# Altium project DSO_Template.PrjPCB
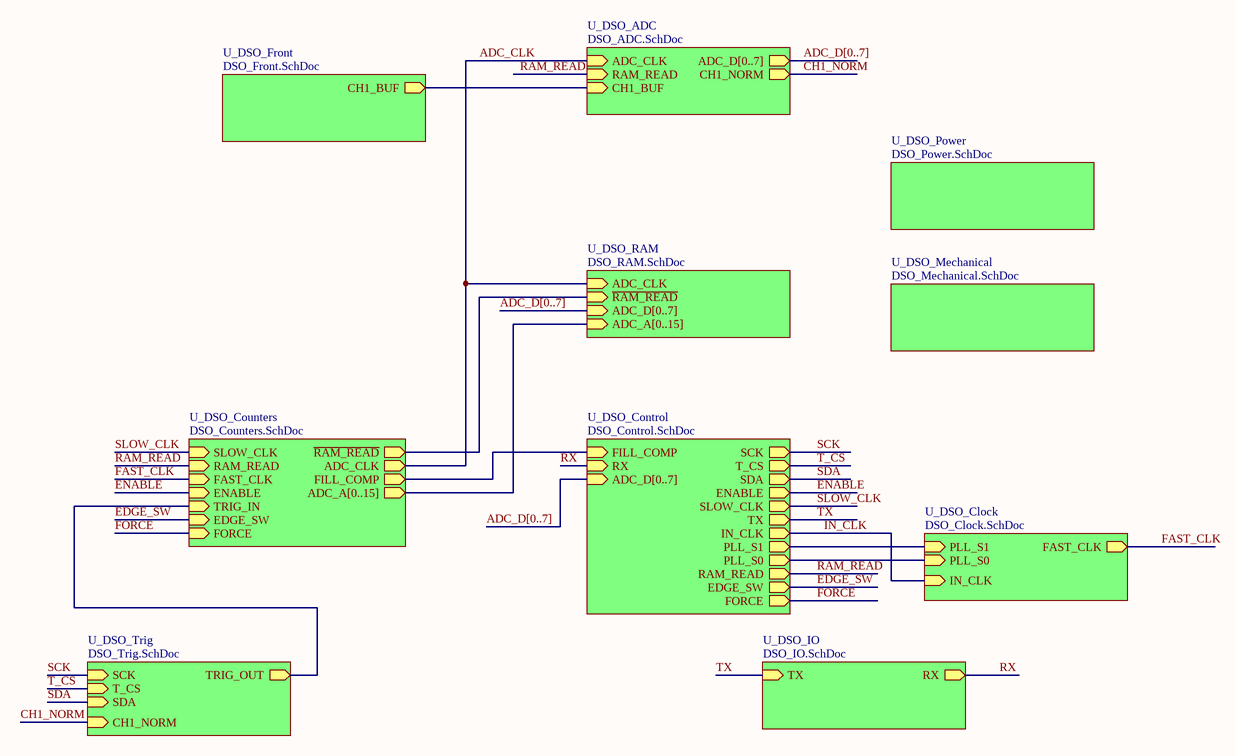
[diagram p0: DSO_Top.SchDoc]
12 sheets, 123 parts. Net scope: hierarchical (ports join the sheet entries above them; power ports are global).
Board file: DSO.PcbDoc
Sheets:
  DSO_Top.SchDoc
    U_DSO_Front = DSO_Front.SchDoc
    U_DSO_ADC = DSO_ADC.SchDoc
    U_DSO_RAM = DSO_RAM.SchDoc
    U_DSO_Counters = DSO_Counters.SchDoc
      U_DSO_CPLD = DSO_CPLD.SchDoc
    U_DSO_Control = DSO_Control.SchDoc
    U_DSO_Trig = DSO_Trig.SchDoc
    U_DSO_Clock = DSO_Clock.SchDoc
    U_DSO_IO = DSO_IO.SchDoc
    U_DSO_Power = DSO_Power.SchDoc
    U_DSO_Mechanical = DSO_Mechanical.SchDoc

## Sheet DSO_Top.SchDoc: DSO_Top
size A4; CompanyName: University of Melbourne; DrawnBy: Yijie Tao; Engineer: Yijie Tao; DocumentNumber: 1; Revision: 0.1; SheetNumber: 1; SheetTotal: 1; Title_Project: DSO; StudentNo: Student No. 755391

### Sub-sheets
U_DSO_ADC = DSO_ADC.SchDoc: ADC_CLK (in), ADC_D[0..7] (out), RAM_READ (in), CH1_BUF (in), CH1_NORM (out)
U_DSO_Clock = DSO_Clock.SchDoc: FAST_CLK (out), PLL_S0 (in), PLL_S1 (in), IN_CLK (in)
U_DSO_Control = DSO_Control.SchDoc: SCK (out), T_CS (out), SDA (out), ENABLE (out), FILL_COMP (in), SLOW_CLK (out), TX (out), RX (in), IN_CLK (out), PLL_S1 (out), PLL_S0 (out), RAM_READ (out), ADC_D[0..7] (in), EDGE_SW (out), FORCE (out)
U_DSO_Counters = DSO_Counters.SchDoc: SLOW_CLK (in), ~{RAM_READ} (out), ADC_CLK (out), RAM_READ (in), FAST_CLK (in), FILL_COMP (out), ENABLE (in), TRIG_IN (in), EDGE_SW (in), FORCE (in), ADC_A[0..15] (out)
U_DSO_Front = DSO_Front.SchDoc: CH1_BUF (out)
U_DSO_IO = DSO_IO.SchDoc: TX (in), RX (out)
U_DSO_Mechanical = DSO_Mechanical.SchDoc: no entries
U_DSO_Power = DSO_Power.SchDoc: no entries
U_DSO_RAM = DSO_RAM.SchDoc: ADC_CLK (in), ~{RAM_READ} (in), ADC_D[0..7] (in), ADC_A[0..15] (in)
U_DSO_Trig = DSO_Trig.SchDoc: TRIG_OUT (out), SCK (in), T_CS (in), SDA (in), CH1_NORM (in)

### Nets
ADC_CLK: sheet U_DSO_ADC/ADC_CLK, sheet U_DSO_RAM/ADC_CLK, sheet U_DSO_Counters/ADC_CLK
CH1_NORM: sheet U_DSO_ADC/CH1_NORM, sheet U_DSO_Trig/CH1_NORM
EDGE_SW: sheet U_DSO_Counters/EDGE_SW, sheet U_DSO_Control/EDGE_SW
ENABLE: sheet U_DSO_Counters/ENABLE, sheet U_DSO_Control/ENABLE
FAST_CLK: sheet U_DSO_Counters/FAST_CLK, sheet U_DSO_Clock/FAST_CLK
FILL_COMP: sheet U_DSO_Counters/FILL_COMP, sheet U_DSO_Control/FILL_COMP
FORCE: sheet U_DSO_Counters/FORCE, sheet U_DSO_Control/FORCE
IN_CLK: sheet U_DSO_Control/IN_CLK, sheet U_DSO_Clock/IN_CLK
~{RAM_READ}: sheet U_DSO_RAM/~{RAM_READ}, sheet U_DSO_Counters/~{RAM_READ}
RAM_READ: sheet U_DSO_ADC/RAM_READ, sheet U_DSO_Counters/RAM_READ, sheet U_DSO_Control/RAM_READ
RX: sheet U_DSO_Control/RX, sheet U_DSO_IO/RX
SCK: sheet U_DSO_Control/SCK, sheet U_DSO_Trig/SCK
SDA: sheet U_DSO_Control/SDA, sheet U_DSO_Trig/SDA
SLOW_CLK: sheet U_DSO_Counters/SLOW_CLK, sheet U_DSO_Control/SLOW_CLK
T_CS: sheet U_DSO_Control/T_CS, sheet U_DSO_Trig/T_CS
TX: sheet U_DSO_Control/TX, sheet U_DSO_IO/TX
NetR6_2: sheet U_DSO_Front/CH1_BUF, sheet U_DSO_ADC/CH1_BUF
NetU7_4: sheet U_DSO_Control/PLL_S1, sheet U_DSO_Clock/PLL_S1
NetU7_6: sheet U_DSO_Control/PLL_S0, sheet U_DSO_Clock/PLL_S0
NetU13_12: sheet U_DSO_Counters/TRIG_IN, sheet U_DSO_Trig/TRIG_OUT

### Buses and harness runs
bus ADC_D[0..7] = sheet U_DSO_ADC/ADC_D[0..7]
bus ADC_D[0..7] = sheet U_DSO_Control/ADC_D[0..7]
bus ADC_D[0..7] = sheet U_DSO_RAM/ADC_D[0..7]
bus sheet U_DSO_Counters/ADC_A[0..15] = sheet U_DSO_RAM/ADC_A[0..15]

## Sheet DSO_Front.SchDoc: Schematic_Name
size A4; CompanyName: University of Melbourne; Engineer: Your Name Here; DocumentNumber: 1; Revision: 0.1; SheetNumber: 1; SheetTotal: 1; Title_Project: Project_Title; StudentNo: Student No.
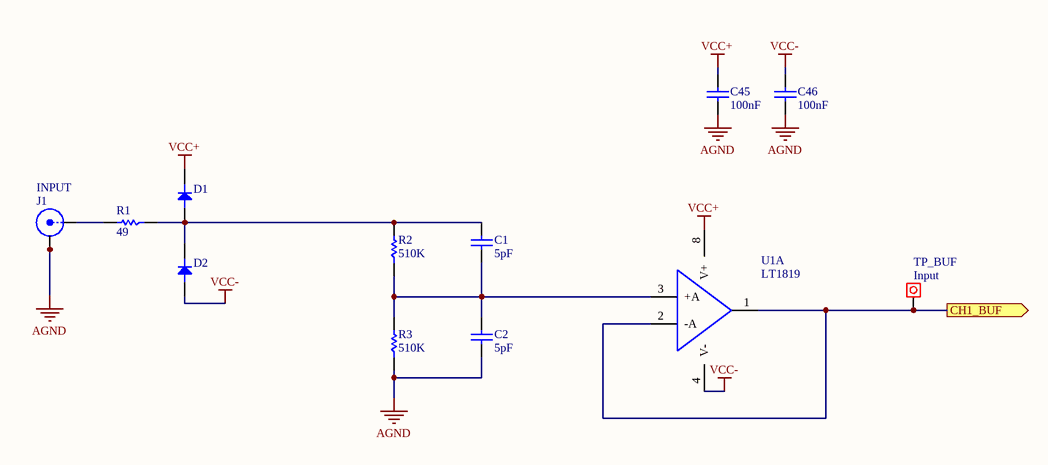
[diagram p1: DSO_Front.SchDoc]

### Parts
C1  5pF  [0805C]
C2  5pF  [0805C]
C45  100nF  [0805C]
C46  100nF  [0805C]
D1  Diode  [SOD-123]  (value not drawn)
D2  Diode  [SOD-123]  (value not drawn)
J1  INPUT  [BNC_VERT]
R1  49  [0805]
R2  510K  [0805]
R3  510K  [0805]
TP_BUF  INPUT  [Testpoin]
U1  LT1819  [SOIC-8]  (part A of 2)

### Ports
CH1_BUF (out)

### Nets
AGND: C2.2 C45.2 C46.2 J1.2(Y) J1.3(Y) J1.4(Y) J1.5(Y) R3.1
VCC+: C45.1 D1.K U1.8(V+)
VCC-: C46.1 D2.A U1.4(V-)
NetC1_1: C1.1 D1.A D2.K R1.1 R2.2
NetC1_2: C1.2 C2.1 R2.1 R3.2 U1.3(+A)
NetJ1_1: J1.1(X) R1.2
NetR6_2: TP_BUF.1 U1.1(OUTA) U1.2(-A) ; port CH1_BUF

### Library data of the parts
C1 C2 C45 C46 = C: Capacitor; Reviewed by: RM - 2018/08/05; Revision: July-2002: Re-released for DXP Platform.; Supplier 1: *; Supplier Part Number 1: *
  C1 C2: Value: 5pF
  C45 C46: Value: 100nF
D1 D2 = D: Reviewed by: RM - 2018/08/05; Revision: July-2002: Re-released for DXP Platform.; Supplier 1: *; Supplier Part Number 1: *
J1 = BNC: BNC Straight; Reviewed by: RM - 2018/08/05; Supplier Part Number 1: A97581-ND; Supplier 1: Digi-Key
R1-R3 = R: Resistor; Reviewed by: RM - 2018/08/05; Supplier 1: *; Suppler Part Number 1: *
  R1: Value: 49
  R2 R3: Value: 510K
TP_BUF = Test Point: Pad; Value: Input
U1 = LT1819: OpAmp High Frequency Dual; Reviewed by: RM - 2018/08/05; Supplier 1: Digi-Key; Supplier Part Number 1: LT1819CMS8#PBF-ND

## Sheet DSO_ADC.SchDoc: Schematic_Name
size A4; CompanyName: University of Melbourne; Engineer: Yijie Tao; DocumentNumber: 1; Revision: 0.1; SheetNumber: 1; SheetTotal: 1; Title_Project: DSO; StudentNo: Student No. 755391
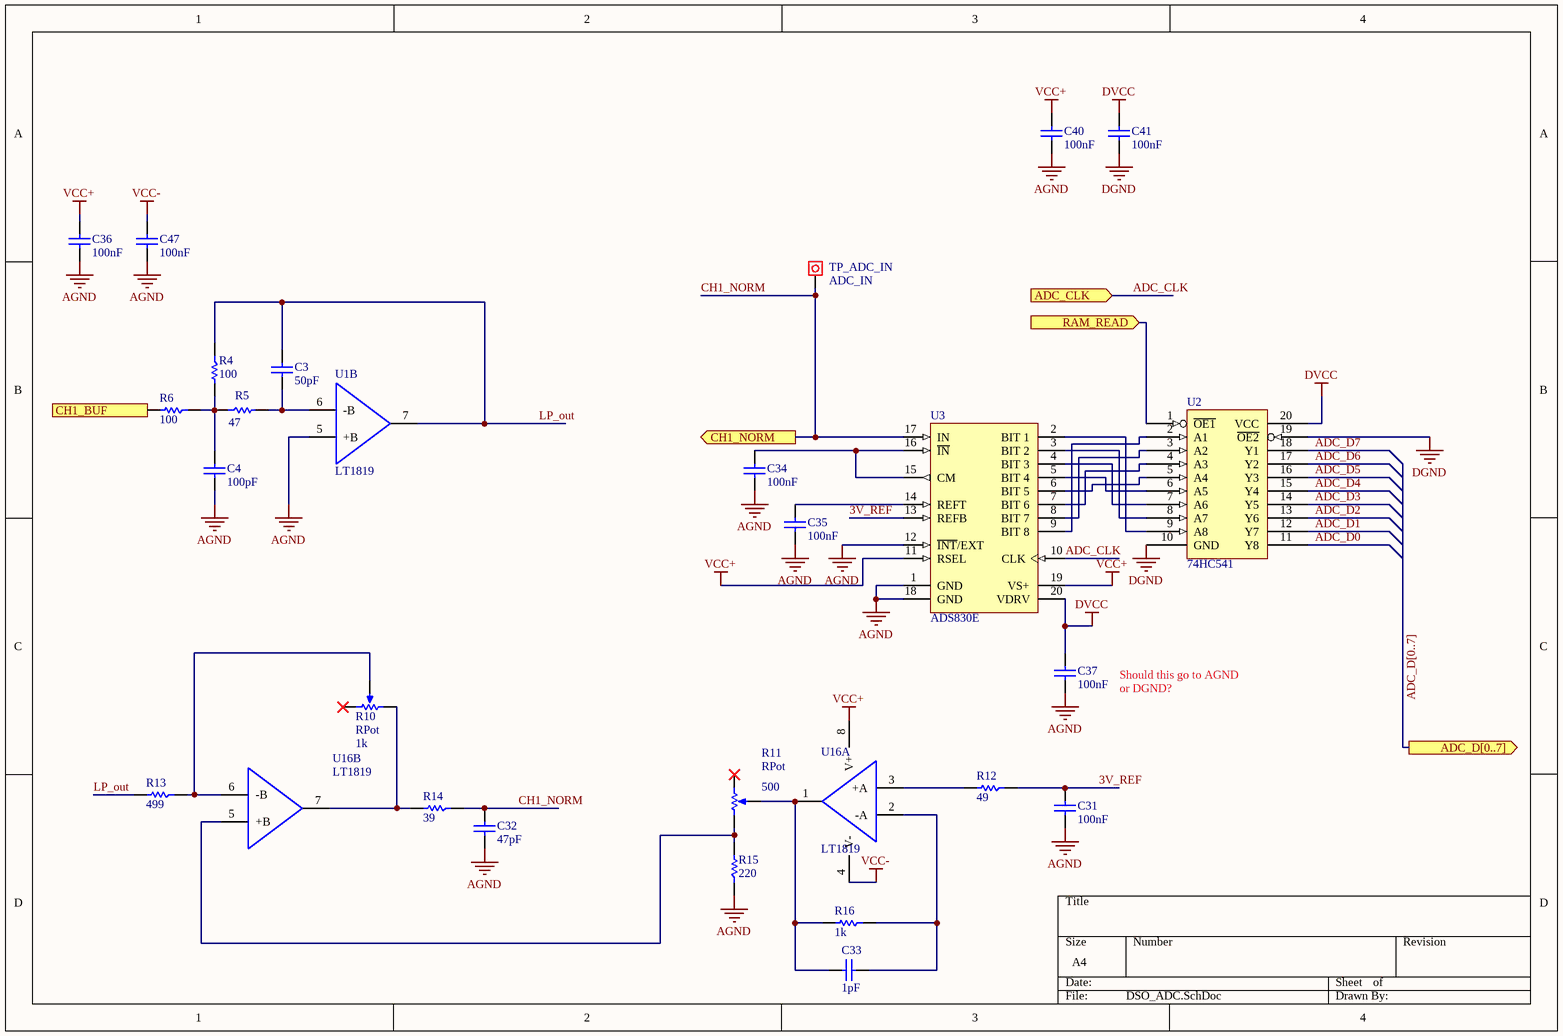
[diagram p2: DSO_ADC.SchDoc]

### Parts
C3  50pF  [0805C]
C4  100pF  [0805C]
C31  100nF  [0805C]
C32  47pF  [0805C]
C33  1pF  [0805C]
C34  100nF  [0805C]
C35  100nF  [0805C]
C36  100nF  [0805C]
C37  100nF  [0805C]
C40  100nF  [0805C]
C41  100nF  [0805C]
C47  100nF  [0805C]
R4  100  [0805]
R5  47  [0805]
R6  100  [0805]
R10  RPot  value 1k  [VR5]
R11  RPot  value 500  [VR5]
R12  49  [0805]
R13  499  [0805]
R14  39  [0805]
R15  220  [0805]
R16  1k  [0805]
TP_ADC_IN  value ADC_IN  [Testpoin]  (hidden comment: INPUT)
U1  LT1819  [SOIC-8]  (part B of 2)
U2  74HC541  [SOT163-1_N]
U3  ADS830E  [TI-DBQ20_L]
U16  LT1819  [SOIC-8]  (parts A,B of 2)

### Ports
ADC_CLK (in), ADC_D[0..7] (out), CH1_BUF (in), CH1_NORM (out), RAM_READ (in)

### Nets
AGND: C4.2 C31.2 C32.2 C34.2 C35.2 C36.2 C37.1 C40.2 C47.2 R15.1 U1.5(+B) U3.1(GND) U3.12(~{INT}/EXT) U3.18(GND)
DGND: C41.2 U2.10(GND) U2.19(~{OE2})
DVCC: C37.2 C41.1 U2.20(VCC) U3.20(VDRV)
VCC+: C36.1 C40.1 U3.11(RSEL) U3.19(VS+) U16.8(V+)
VCC-: C47.1 U16.4(V-)
3V_REF: C31.1 R12.1 U3.13(REFB)
ADC_CLK: U3.10(CLK) ; port ADC_CLK
ADC_D0: U2.11(Y8)
ADC_D1: U2.12(Y7)
ADC_D2: U2.13(Y6)
ADC_D3: U2.14(Y5)
ADC_D4: U2.15(Y4)
ADC_D5: U2.16(Y3)
ADC_D6: U2.17(Y2)
ADC_D7: U2.18(Y1)
CH1_NORM: C32.1 R14.1 TP_ADC_IN.1 U3.17(IN) ; port CH1_NORM
LP_out: C3.1 R4.1 R13.2 U1.7(OUTB)
RAM_READ: U2.1(~{OE1}) ; port RAM_READ
NetC3_2: C3.2 R5.2 U1.6(-B)
NetC4_1: C4.1 R4.2 R5.1 R6.1
NetC33_1: C33.1 R16.1 U16.2(-A)
NetC33_2: C33.2 R11.2(TAP) R16.2 U16.1(OUTA)
NetC34_1: C34.1 U3.15(CM) U3.16(~{IN})
NetC35_1: C35.1 U3.14(REFT)
NetR6_2: R6.2 ; port CH1_BUF
NetR10_1: R10.1(TOP) R14.2 U16.7(OUTB)
NetR10_2: R10.2(TAP) R13.1 U16.6(-B)
NetR11_1: R11.1(TOP) R15.2 U16.5(+B)
NetR12_2: R12.2 U16.3(+A)
NetU2_2: U2.2(A1) U3.9(BIT_8)
NetU2_3: U2.3(A2) U3.8(BIT_7)
NetU2_4: U2.4(A3) U3.7(BIT_6)
NetU2_5: U2.5(A4) U3.6(BIT_5)
NetU2_6: U2.6(A5) U3.5(BIT_4)
NetU2_7: U2.7(A6) U3.4(BIT_3)
NetU2_8: U2.8(A7) U3.3(BIT_2)
NetU2_9: U2.9(A8) U3.2(BIT_1)

Not connected (* = marked no-connect by the designer): R10 3(BOT)*; R11 3(BOT)*

### Buses and harness runs
bus ADC_D[0..7] = port ADC_D[0..7]

### Notes on the sheet
- Should this go to AGND or DGND?

### Library data of the parts
C3 C4 C31-C37 C40 C41 C47 = C: Capacitor; Reviewed by: RM - 2018/08/05; Revision: July-2002: Re-released for DXP Platform.; Supplier 1: *; Supplier Part Number 1: *
  C3: Value: 50pF
  C4: Value: 100pF
  C31 C34-C37 C40 C41 C47: Value: 100nF
  C32: Value: 47pF
  C33: Value: 1pF
R4-R6 R12-R16 = R: Resistor; Reviewed by: RM - 2018/08/05; Supplier 1: *; Suppler Part Number 1: *
  R4 R6: Value: 100
  R5: Value: 47
  R12: Value: 49
  R13: Value: 499
  R14: Value: 39
  R15: Value: 220
  R16: Value: 1k
R10 R11 = RPot: Potentiometer; Sim Note: Enter the Resistance value and the set point into parameter fields.; Set Position: 0.5; Published: 8-Jun-2000; LatestRevisionDate: 17-Jul-2002; LatestRevisionNote: Re-released for DXP Platform.; PackageReference: VR5; Publisher: Altium Limited; PackageDescription: Variable Resistor, Thru-Hole; 3 Leads
TP_ADC_IN = Test Point: Pad
U1 U16 = LT1819: as U1 on sheet DSO_Front; Supplier 1: Digi-Key; Supplier Part Number 1: LT1819CMS8#PBF-ND
U2 = 74HC541: (ADV) Octal Buffer, Line Driver; Reviewed by: RM - 2018/08/05; Supplier 1: Digi-Key; Supplier Part Number 1: 296-1202-1-ND
U3 = ADS830E: 8-Bit, 60 MSPS ADC Single-Ended / Differential Input, Internal / External Reference and Programmble Input Range, -40 to 85 degC, 20-pin SOP (DBQ20), Green (RoHS & no Sb/Br); Reviewed by: RM - 2018/08/05; ComponentLink2URL: http://www.ti.com/general/docs/lit/getliterature.tsp?genericPartNumber=ADS830&fileType=pdf; ComponentLink2Description: Datasheet; ComponentLink1URL: http://www.ti.com/; ComponentLink3URL: http://www.ti.com/litv/pdf/mpds210a; ComponentLink3Description: Package Specification; ComponentLink1Description: Manufacturer URL; Supplier 1: Digi-Key; Supplier Part Number 1: ADS830E-ND

## Sheet DSO_RAM.SchDoc: Schematic_Name
size A4; CompanyName: University of Melbourne; Engineer: Your Name Here; DocumentNumber: 1; Revision: 0.1; SheetNumber: 1; SheetTotal: 1; Title_Project: Project_Title; StudentNo: Student No.
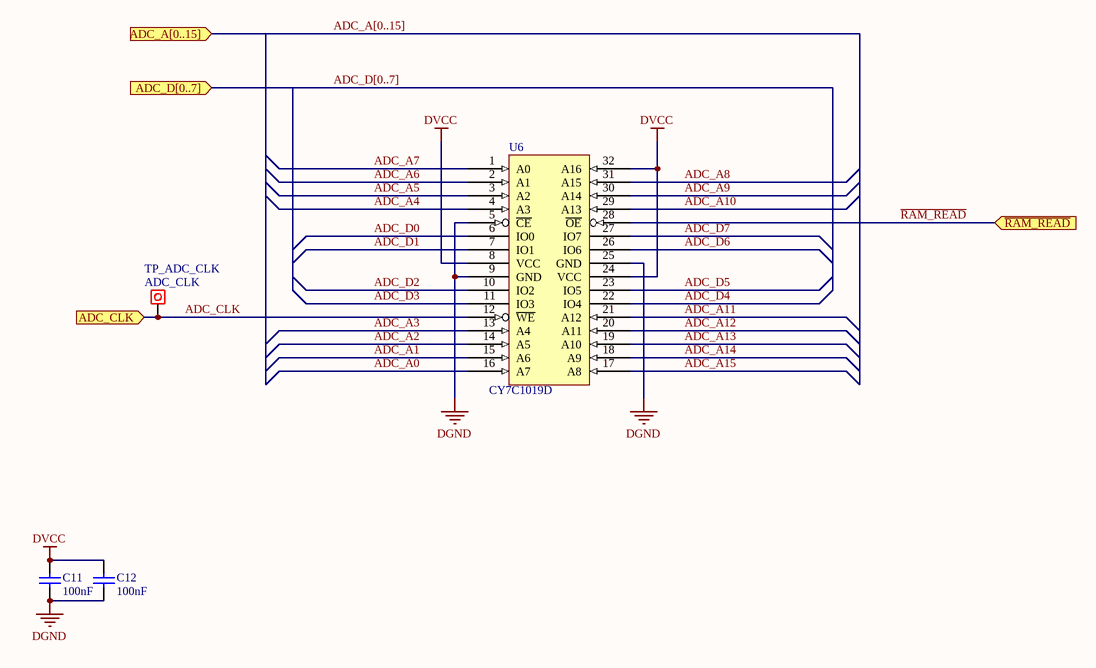
[diagram p3: DSO_RAM.SchDoc]

### Parts
C11  100nF  [0805C]
C12  100nF  [0805C]
TP_ADC_CLK  value ADC_CLK  [Testpoin]  (hidden comment: INPUT)
U6  CY7C1019D  [TSOP-32]

### Ports
ADC_A[0..15] (in), ADC_CLK (in), ADC_D[0..7] (in), ~{RAM_READ} (in)

### Nets
DGND: C11.2 C12.2 U6.5(~{CE}) U6.9(GND) U6.25(GND)
DVCC: C11.1 C12.1 U6.8(VCC) U6.24(VCC) U6.32(A16)
ADC_A0: U6.16(A7)
ADC_A1: U6.15(A6)
ADC_A2: U6.14(A5)
ADC_A3: U6.13(A4)
ADC_A4: U6.4(A3)
ADC_A5: U6.3(A2)
ADC_A6: U6.2(A1)
ADC_A7: U6.1(A0)
ADC_A8: U6.31(A15)
ADC_A9: U6.30(A14)
ADC_A10: U6.29(A13)
ADC_A11: U6.21(A12)
ADC_A12: U6.20(A11)
ADC_A13: U6.19(A10)
ADC_A14: U6.18(A9)
ADC_A15: U6.17(A8)
ADC_CLK: TP_ADC_CLK.1 U6.12(~{WE}) ; port ADC_CLK
ADC_D0: U6.6(IO0)
ADC_D1: U6.7(IO1)
ADC_D2: U6.10(IO2)
ADC_D3: U6.11(IO3)
ADC_D4: U6.22(IO4)
ADC_D5: U6.23(IO5)
ADC_D6: U6.26(IO6)
ADC_D7: U6.27(IO7)
~{RAM_READ}: U6.28(~{OE}) ; port ~{RAM_READ}

### Buses and harness runs
bus ADC_A[0..15] = port ADC_A[0..15]
bus ADC_D[0..7] = port ADC_D[0..7]

### Library data of the parts
C11 C12 = C: Capacitor; Reviewed by: RM - 2018/08/05; Revision: July-2002: Re-released for DXP Platform.; Value: 100nF; Supplier 1: *; Supplier Part Number 1: *
TP_ADC_CLK = Test Point: Pad
U6 = CY7C1019D: SRAM 128k x 8; Reviewed by: RM - 2018/08/05; Supplier 1: Digi-Key; Supplier Part Number 1: 428-1967-ND

## Sheet DSO_Counters.SchDoc: Schematic_Name
size A4; CompanyName: University of Melbourne; DrawnBy: Student_#; Engineer: Your Name Here; Organization: University of Melbourne; DocumentNumber: 5; Revision: 0.1; SheetNumber: 5; SheetTotal: 10; Title_Project: Project_Title
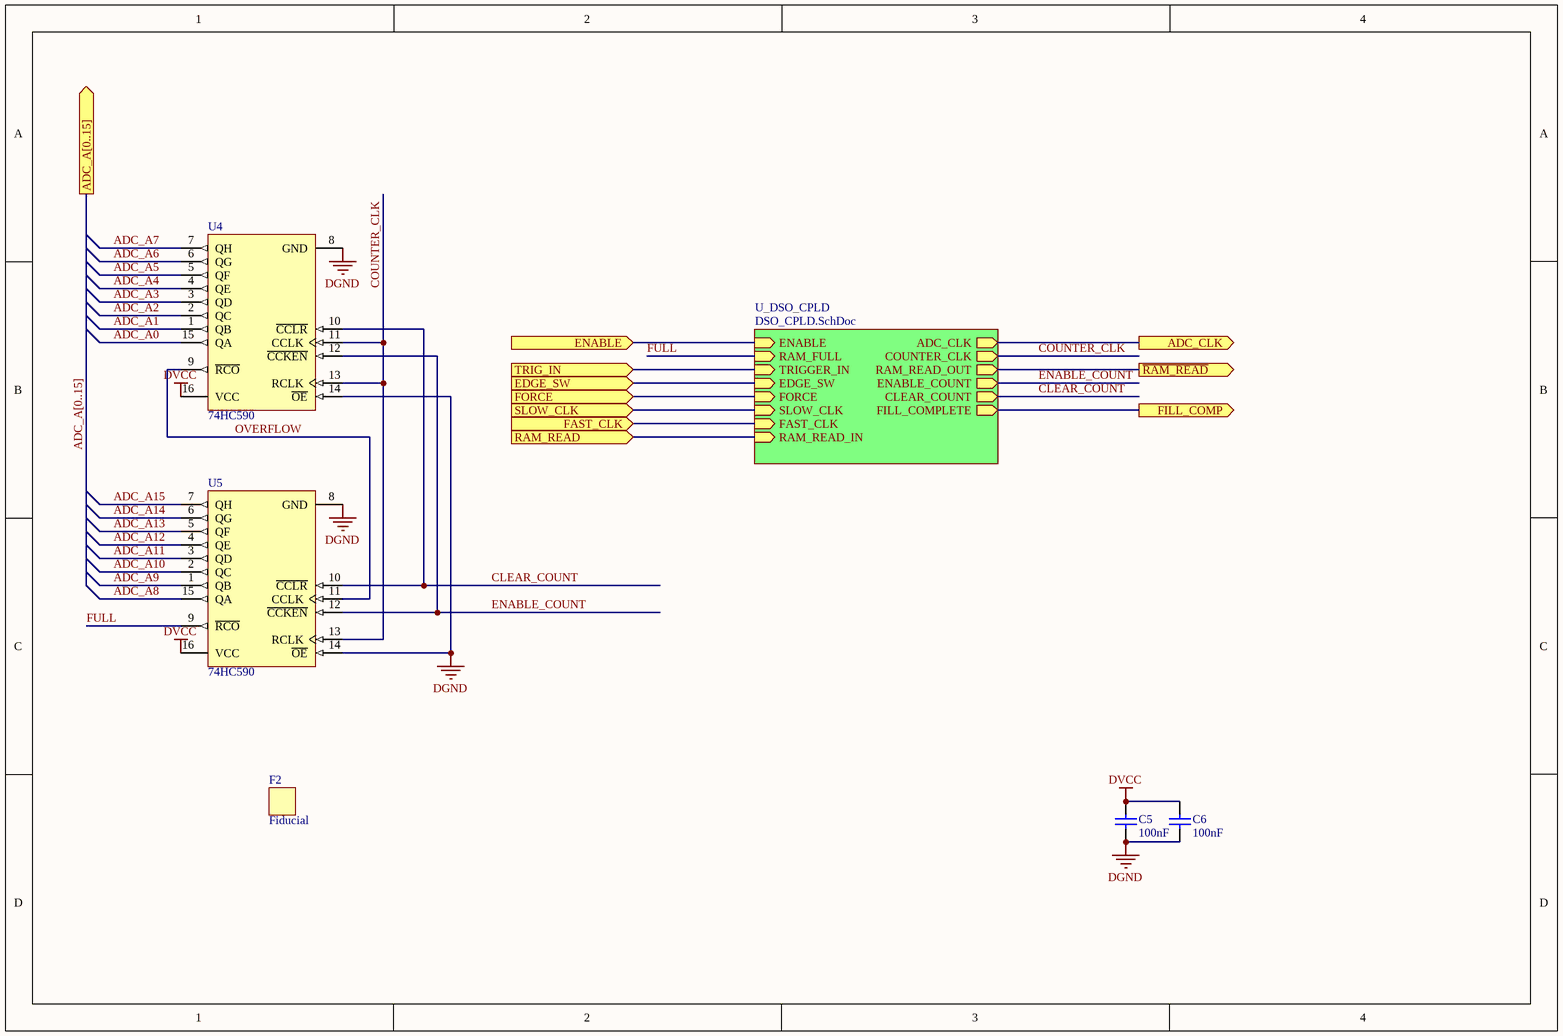
[diagram p4: DSO_Counters.SchDoc]

### Parts
C5  100nF  [0805C]
C6  100nF  [0805C]
F2  Fiducial  [Fiducial]  (no BOM)
U4  74HC590  [SOIC-16]
U5  74HC590  [SOIC-16]

### Sub-sheets
U_DSO_CPLD = DSO_CPLD.SchDoc: ENABLE (in), RAM_FULL (in), TRIGGER_IN (in), EDGE_SW (in), FORCE (in), SLOW_CLK (in), FAST_CLK (in), RAM_READ_IN (in), ADC_CLK (out), COUNTER_CLK (out), RAM_READ_OUT (out), ENABLE_COUNT (out), CLEAR_COUNT (out), FILL_COMPLETE (out)

### Ports
ADC_A[0..15] (out), ADC_CLK (out), EDGE_SW (in), ENABLE (in), FAST_CLK (in), FILL_COMP (out), FORCE (in), RAM_READ (in), SLOW_CLK (in), TRIG_IN (in), ~{RAM_READ} (out)

### Nets
DGND: C5.2 C6.2 U4.8(GND) U4.14(~{OE}) U5.8(GND) U5.14(~{OE})
DVCC: C5.1 C6.1 U4.16(VCC) U5.16(VCC)
ADC_A0: U4.15(QA)
ADC_A1: U4.1(QB)
ADC_A2: U4.2(QC)
ADC_A3: U4.3(QD)
ADC_A4: U4.4(QE)
ADC_A5: U4.5(QF)
ADC_A6: U4.6(QG)
ADC_A7: U4.7(QH)
ADC_A8: U5.15(QA)
ADC_A9: U5.1(QB)
ADC_A10: U5.2(QC)
ADC_A11: U5.3(QD)
ADC_A12: U5.4(QE)
ADC_A13: U5.5(QF)
ADC_A14: U5.6(QG)
ADC_A15: U5.7(QH)
ADC_CLK: port ADC_CLK, sheet U_DSO_CPLD/ADC_CLK
CLEAR_COUNT: U4.10(~{CCLR}) U5.10(~{CCLR}) ; sheet U_DSO_CPLD/CLEAR_COUNT
COUNTER_CLK: U4.11(CCLK) U4.13(RCLK) U5.13(RCLK) ; sheet U_DSO_CPLD/COUNTER_CLK
EDGE_SW: port EDGE_SW, sheet U_DSO_CPLD/EDGE_SW
ENABLE: port ENABLE, sheet U_DSO_CPLD/ENABLE
ENABLE_COUNT: U4.12(~{CCKEN}) U5.12(~{CCKEN}) ; sheet U_DSO_CPLD/ENABLE_COUNT
FAST_CLK: port FAST_CLK, sheet U_DSO_CPLD/FAST_CLK
FILL_COMP: port FILL_COMP, sheet U_DSO_CPLD/FILL_COMPLETE
FORCE: port FORCE, sheet U_DSO_CPLD/FORCE
FULL: U5.9(~{RCO}) ; sheet U_DSO_CPLD/RAM_FULL
OVERFLOW: U4.9(~{RCO}) U5.11(CCLK)
~{RAM_READ}: port ~{RAM_READ}, sheet U_DSO_CPLD/RAM_READ_OUT
RAM_READ: port RAM_READ, sheet U_DSO_CPLD/RAM_READ_IN
SLOW_CLK: port SLOW_CLK, sheet U_DSO_CPLD/SLOW_CLK
NetU13_12: port TRIG_IN, sheet U_DSO_CPLD/TRIGGER_IN

### Buses and harness runs
bus ADC_A[0..15] = port ADC_A[0..15]

### Library data of the parts
C5 C6 = C: Capacitor; Reviewed by: RM - 2018/08/05; Revision: July-2002: Re-released for DXP Platform.; Value: 100nF; Supplier 1: *; Supplier Part Number 1: *
U4 U5 = 74HC590: 8-Bit Binary Counter Register; Reviewed by: RM - 2018/08/05; ComponentLink1Description: Manufacturer Link; ComponentLink1URL: http://www.st.com/; ComponentLink2Description: Datasheet; ComponentLink2URL: http://www.st.com/stonline/products/literature/ds/1986/m74hc590.pdf; Supplier 1: Digi-Key; Supplier Part Number 1: 296-17132-1-ND

## Sheet DSO_CPLD.SchDoc
size A4
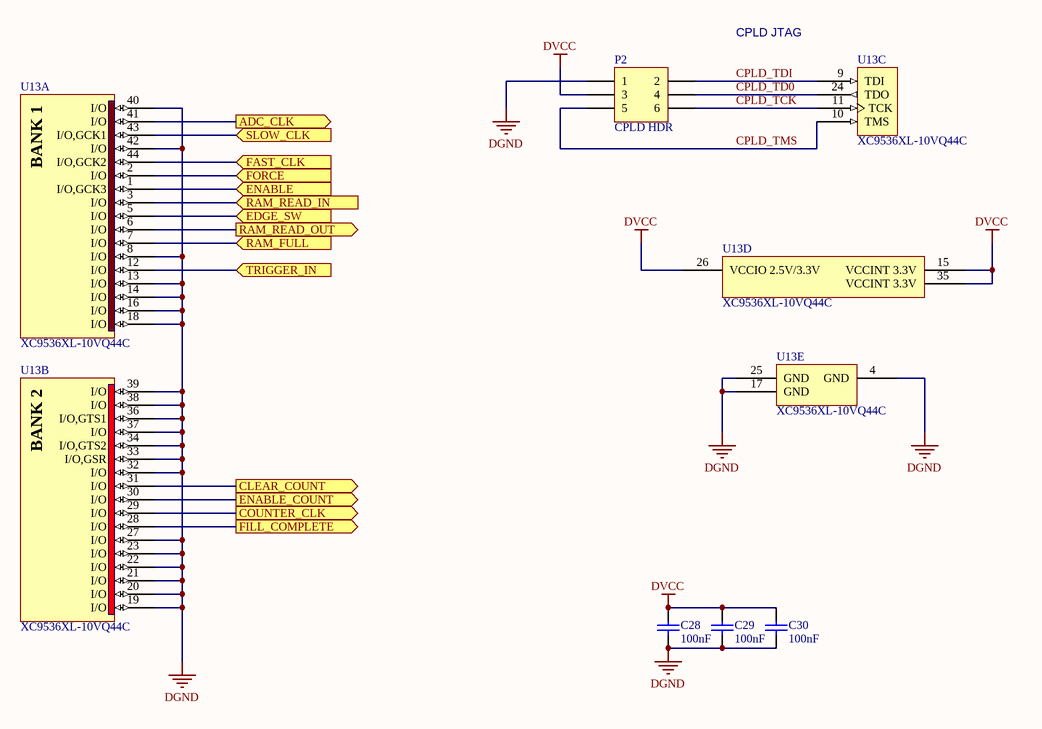
[diagram p5: DSO_CPLD.SchDoc]

### Parts
C28  100nF  [0805C]
C29  100nF  [0805C]
C30  100nF  [0805C]
P2  CPLD HDR  [HDR3x2]
U13  XC9536XL-10VQ44C  [VQ44_L]  (parts A,B,C,D,E of 5)

### Ports
ADC_CLK (out), CLEAR_COUNT (out), COUNTER_CLK (out), EDGE_SW (in), ENABLE (in), ENABLE_COUNT (out), FAST_CLK (in), FILL_COMPLETE (out), FORCE (in), RAM_FULL (in), RAM_READ_IN (in), RAM_READ_OUT (out), SLOW_CLK (in), TRIGGER_IN (in)

### Nets
DGND: C28.2 C29.2 C30.2 P2.1 U13.4(GND) U13.8(I/O) U13.13(I/O) U13.14(I/O) U13.16(I/O) U13.17(GND) U13.18(I/O) U13.19(I/O) U13.20(I/O) U13.21(I/O) U13.22(I/O) U13.23(I/O) U13.25(GND) U13.27(I/O) U13.32(I/O) U13.33(I/O,GSR) U13.34(I/O,GTS2) U13.36(I/O,GTS1) U13.37(I/O) U13.38(I/O) U13.39(I/O) U13.40(I/O) U13.42(I/O)
DVCC: C28.1 C29.1 C30.1 P2.3 U13.15(VCCINT_3.3V) U13.26(VCCIO_2.5V/3.3V) U13.35(VCCINT_3.3V)
ADC_CLK: U13.41(I/O) ; port ADC_CLK
CLEAR_COUNT: U13.31(I/O) ; port CLEAR_COUNT
COUNTER_CLK: U13.29(I/O) ; port COUNTER_CLK
CPLD_TCK: P2.6 U13.11(TCK)
CPLD_TD0: P2.4 U13.24(TDO)
CPLD_TDI: P2.2 U13.9(TDI)
CPLD_TMS: P2.5 U13.10(TMS)
EDGE_SW: U13.5(I/O) ; port EDGE_SW
ENABLE: U13.1(I/O,GCK3) ; port ENABLE
ENABLE_COUNT: U13.30(I/O) ; port ENABLE_COUNT
FAST_CLK: U13.44(I/O,GCK2) ; port FAST_CLK
FILL_COMP: U13.28(I/O) ; port FILL_COMPLETE
FORCE: U13.2(I/O) ; port FORCE
FULL: U13.7(I/O) ; port RAM_FULL
~{RAM_READ}: U13.6(I/O) ; port RAM_READ_OUT
RAM_READ: U13.3(I/O) ; port RAM_READ_IN
SLOW_CLK: U13.43(I/O,GCK1) ; port SLOW_CLK
NetU13_12: U13.12(I/O) ; port TRIGGER_IN

### Notes on the sheet
- CPLD JTAG
- (in symbol XC9536XL-10VQG44C, part A) BANK 1
- (in symbol XC9536XL-10VQG44C, part B) BANK 2

### Library data of the parts
C28-C30 = C: Capacitor; Reviewed by: RM - 2018/08/05; Revision: July-2002: Re-released for DXP Platform.; Value: 100nF; Supplier 1: *; Supplier Part Number 1: *
P2 = Header 3x2: Header, 5-Pin; Reviewed by: RM - 2018/08/05; Supplier 1: Digi-Key; Supplier Part Number 1: 952-2121-ND
U13 = XC9536XL-10VQG44C: FastFLASH XC900XL, 3.3V High-Performance 36 Macrocell CPLD, 34 User I/Os, 44-Pin VQFP, Speed Grade 10, Commercial Grade; Reviewed by: RM - 2018/08/05; Supplier 1: Digi-Key; Supplier Part Number 1: 122-1385-ND

## Sheet DSO_Control.SchDoc: Schematic_Name
size A4; CompanyName: University of Melbourne; Engineer: Your Name Here; DocumentNumber: 1; Revision: 0.1; SheetNumber: 1; SheetTotal: 1; Title_Project: Project_Title; StudentNo: Student No.
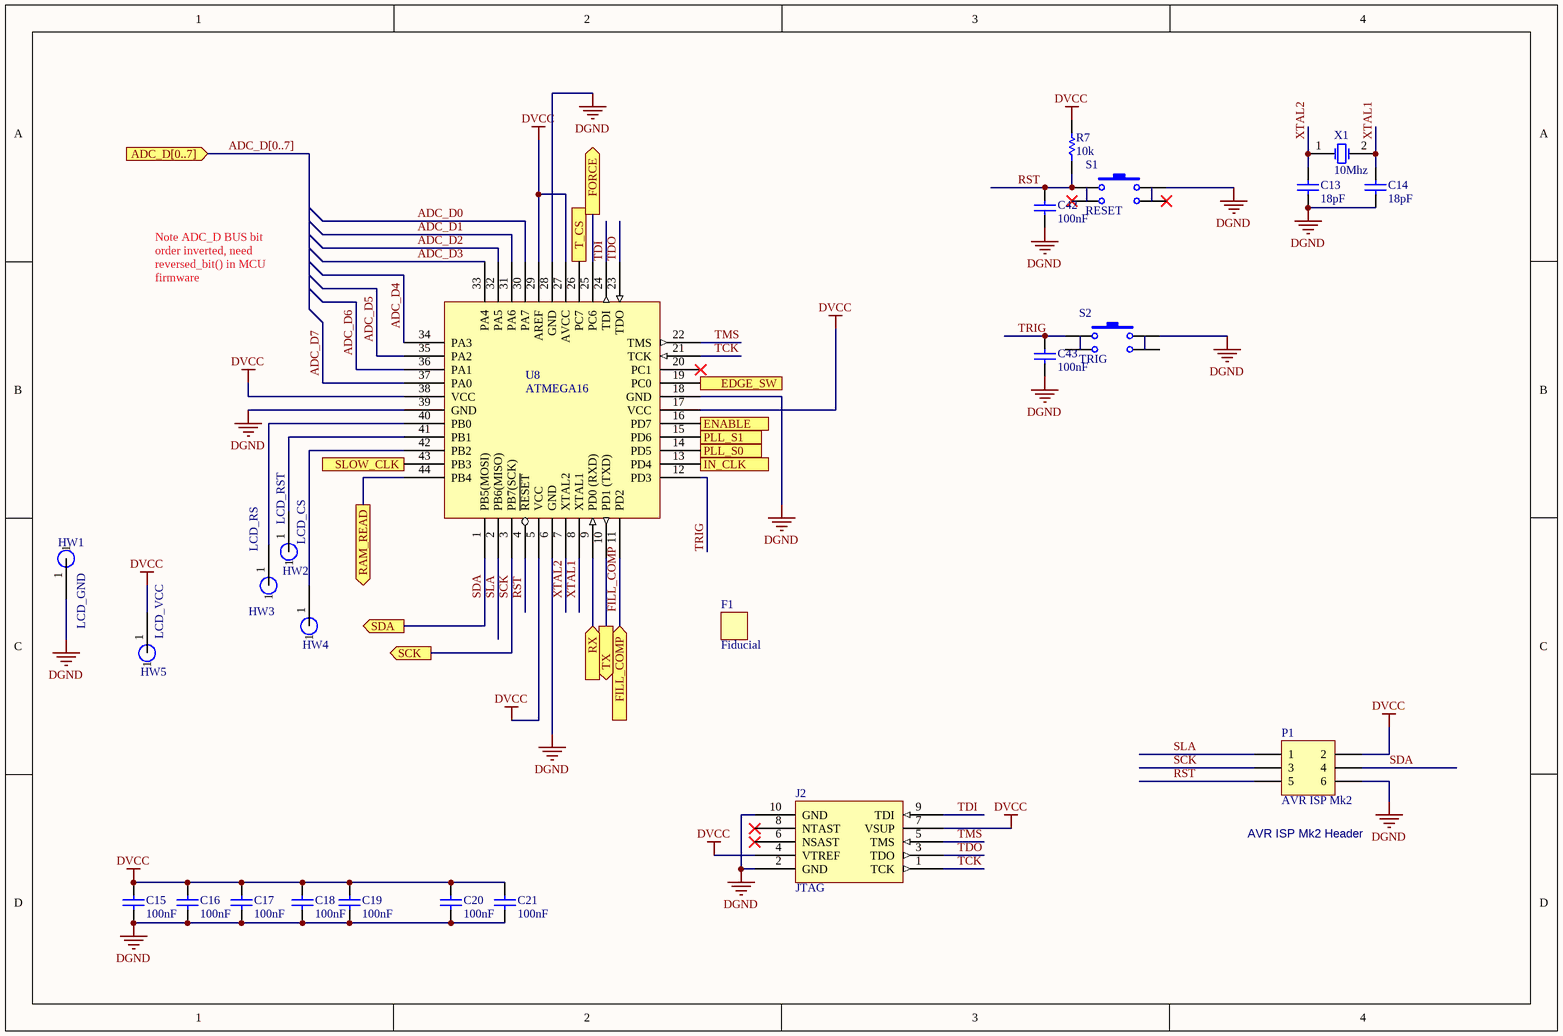
[diagram p6: DSO_Control.SchDoc]

### Parts
C13  18pF  [0805C]
C14  18pF  [0805C]
C15  100nF  [0805C]
C16  100nF  [0805C]
C17  100nF  [0805C]
C18  100nF  [0805C]
C19  100nF  [0805C]
C20  100nF  [0805C]
C21  100nF  [0805C]
C42  100nF  [0805C]
C43  100nF  [0805C]
F1  Fiducial  [Fiducial]  (no BOM)
HW1  LCD_GND  [HOLE_FOR_WIRE]  (no BOM)
HW2  LCD_RST  [HOLE_FOR_WIRE]  (no BOM)
HW3  LCD_RS  [HOLE_FOR_WIRE]  (no BOM)
HW4  LCD_CS  [HOLE_FOR_WIRE]  (no BOM)
HW5  LCD_VCC  [HOLE_FOR_WIRE]  (no BOM)
J2  JTAG  [BOXEDVERT10]
P1  AVR ISP Mk2  [HDR3x2]
R7  10k  [0805]
S1  RESET  [SPST PB SWITCH SMD]
S2  TRIG  [SPST PB SWITCH SMD]
U8  ATMEGA16  [QFP-48]
X1  10Mhz  [XTAL_FLAT_SMD]

### Ports
ADC_D[0..7] (in), EDGE_SW (out), ENABLE (out), FILL_COMP (in), FORCE (out), IN_CLK (out), PLL_S0 (out), PLL_S1 (out), RAM_READ (out), RX (in), SCK (out), SDA (out), SLOW_CLK (out), T_CS (out), TX (out)

### Nets
DGND: C13.2 C14.2 C15.2 C16.2 C17.2 C18.2 C19.2 C20.2 C21.2 C42.2 C43.2 HW1.1 J2.2(GND) J2.10(GND) P1.6 S1.2 S2.2 U8.6(GND) U8.18(GND) U8.28(GND) U8.39(GND)
DVCC: C15.1 C16.1 C17.1 C18.1 C19.1 C20.1 C21.1 HW5.1 J2.4(VTREF) J2.7(VSUP) P1.2 R7.2 U8.5(VCC) U8.17(VCC) U8.27(AVCC) U8.29(AREF) U8.38(VCC)
ADC_D0: U8.30(PA7)
ADC_D1: U8.31(PA6)
ADC_D2: U8.32(PA5)
ADC_D3: U8.33(PA4)
ADC_D4: U8.34(PA3)
ADC_D5: U8.35(PA2)
ADC_D6: U8.36(PA1)
ADC_D7: U8.37(PA0)
EDGE_SW: U8.19(PC0) ; port EDGE_SW
ENABLE: U8.16(PD7) ; port ENABLE
FILL_COMP: U8.11(PD2) ; port FILL_COMP
FORCE: U8.25(PC6) ; port FORCE
IN_CLK: U8.13(PD4) ; port IN_CLK
RAM_READ: U8.44(PB4) ; port RAM_READ
RST: C42.1 P1.5 R7.1 S1.1 U8.4(~{RESET})
RX: U8.9(PD0_(RXD)) ; port RX
SCK: P1.3 U8.3(PB7(SCK)) ; port SCK
SDA: P1.4 U8.1(PB5(MOSI)) ; port SDA
SLA: P1.1 U8.2(PB6(MISO))
SLOW_CLK: U8.43(PB3) ; port SLOW_CLK
T_CS: U8.26(PC7) ; port T_CS
TCK: J2.1(TCK) U8.21(TCK)
TDI: J2.9(TDI) U8.24(TDI)
TDO: J2.3(TDO) U8.23(TDO)
TMS: J2.5(TMS) U8.22(TMS)
TRIG: C43.1 S2.1 U8.12(PD3)
TX: U8.10(PD1_(TXD)) ; port TX
XTAL1: C14.1 U8.8(XTAL1) X1.2(OSC2)
XTAL2: C13.1 U8.7(XTAL2) X1.1(OSC1)
NetHW2_1: HW2.1 U8.41(PB1)
NetHW3_1: HW3.1 U8.40(PB0)
NetHW4_1: HW4.1 U8.42(PB2)
NetU7_4: U8.15(PD6) ; port PLL_S1
NetU7_6: U8.14(PD5) ; port PLL_S0

Not connected (* = marked no-connect by the designer): J2 6(NSAST)* 8(NTAST)*; S1 3* 4*; S2 3 4; U8 20(PC1)*

### Buses and harness runs
bus ADC_D[0..7] = port ADC_D[0..7]

### Notes on the sheet
- Note ADC_D BUS bit order inverted, need reversed_bit() in MCU firmware
- (near P1) AVR ISP Mk2 Header

### Library data of the parts
C13-C21 C42 C43 = C: Capacitor; Reviewed by: RM - 2018/08/05; Revision: July-2002: Re-released for DXP Platform.; Supplier 1: *; Supplier Part Number 1: *
  C13 C14: Value: 18pF
  C15-C21 C42 C43: Value: 100nF
HW1-HW5 = HOLE_FOR_WIRE: Hole for wire
J2 = JTAG_CON: Reviewed by: RM - 2018/08/05; Supplier 1: Digi-Key; Supplier Part Number 1: OR896-ND
P1 = Header 3x2: as P2 on sheet DSO_CPLD; Supplier 1: Digi-Key; Supplier Part Number 1: 952-2121-ND
R7 = R: Resistor; Reviewed by: RM - 2018/08/05; Value: 10k; Supplier 1: *; Suppler Part Number 1: *
S1 S2 = SW_PB_1P1T4: Momentary Push Button Switch 1P 1T 2pins; Reviewed by: RM - 2018/08/05; Revision: July-2002: Re-released for DXP Platform.; Supplier 1: Digi-Key; Supplier Part Number 1: CKN9085CT-ND
U8 = ATMEGA16: ATMEGA16 Microcontroller; Reviewed by: RM - 2018/08/05; Supplier 1: Digi-Key; Supplier Part Number 1: ATMEGA16A-AU-ND
X1 = XTAL: Crystal Oscillator; Reviewed by: RM - 2018/08/05; Revision: July-2002: Re-released for DXP Platform.; Supplier 1: Digi-Key; Supplier Part Number 1: 887-1080-1-ND

## Sheet DSO_Trig.SchDoc: Schematic_Name
size A4; CompanyName: University of Melbourne; Engineer: Your Name Here; DocumentNumber: 1; Revision: 0.1; SheetNumber: 1; SheetTotal: 1; Title_Project: Project_Title; StudentNo: Student No.
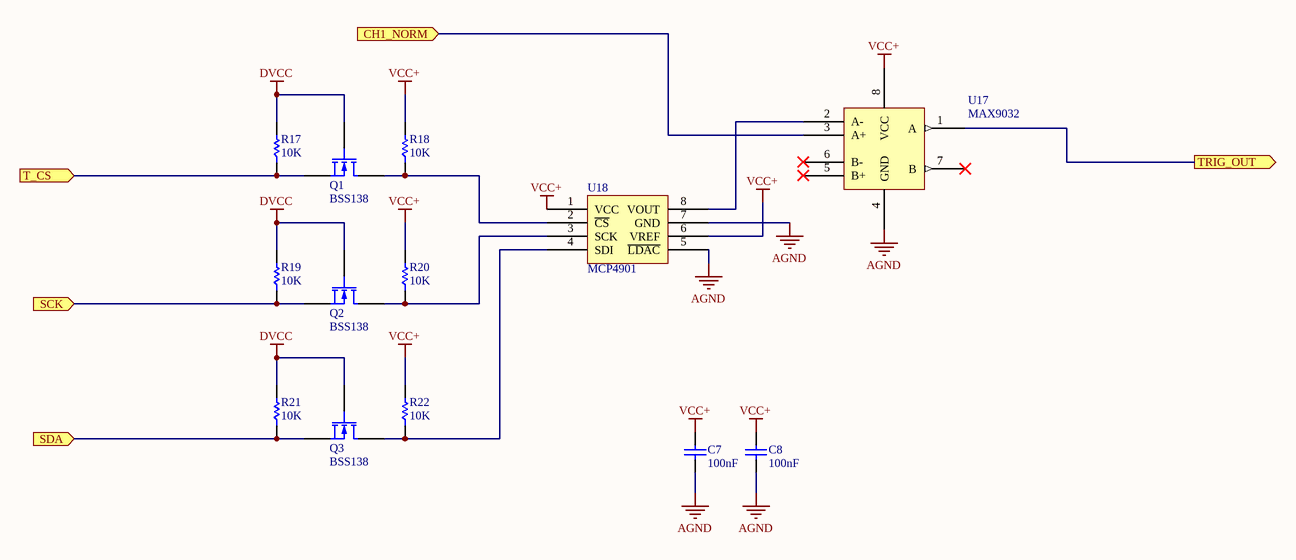
[diagram p7: DSO_Trig.SchDoc]

### Parts
C7  100nF  [0805C]
C8  100nF  [0805C]
Q1  BSS138  [SOT23]
Q2  BSS138  [SOT23]
Q3  BSS138  [SOT23]
R17  10K  [0805]
R18  10K  [0805]
R19  10K  [0805]
R20  10K  [0805]
R21  10K  [0805]
R22  10K  [0805]
U17  MAX9032  [SOIC-8]
U18  MCP4901  [SOIC-8]

### Ports
CH1_NORM (in), SCK (in), SDA (in), T_CS (in), TRIG_OUT (out)

### Nets
AGND: C7.2 C8.2 U17.4(GND) U18.5(~{LDAC}) U18.7(GND)
DVCC: Q1.1 Q2.1 Q3.1 R17.2 R19.2 R21.2
VCC+: C7.1 C8.1 R18.2 R20.2 R22.2 U17.8(VCC) U18.1(VCC) U18.6(VREF)
CH1_NORM: U17.3(A+) ; port CH1_NORM
SCK: Q2.2 R19.1 ; port SCK
SDA: Q3.2 R21.1 ; port SDA
T_CS: Q1.2 R17.1 ; port T_CS
NetQ1_3: Q1.3 R18.1 U18.2(~{CS})
NetQ2_3: Q2.3 R20.1 U18.3(SCK)
NetQ3_3: Q3.3 R22.1 U18.4(SDI)
NetU13_12: U17.1(A) ; port TRIG_OUT
NetU17_2: U17.2(A-) U18.8(VOUT)

Not connected (* = marked no-connect by the designer): U17 5(B+)* 6(B-)* 7(B)*

### Library data of the parts
C7 C8 = C: Capacitor; Reviewed by: RM - 2018/08/05; Revision: July-2002: Re-released for DXP Platform.; Supplier 1: *; Supplier Part Number 1: *; Value: 100nF
Q1-Q3 = MOSFET-N: N-Channel MOSFET; PackageDocument: 1995/1996; Published: 8-Jun-2000; LatestRevisionDate: 17-Jul-2002; LatestRevisionNote: Re-released for DXP Platform.; PackageReference: E3; Publisher: Altium Limited
R17-R22 = R: Resistor; Reviewed by: RM - 2018/08/05; Supplier 1: *; Suppler Part Number 1: *; Value: 10K
U17 = MAX9032: Dual Comparator; Reviewed by: RM - 2018/08/05; Supplier 1: Digi-Key; Supplier Part Number 1: MAX9032ASA-ND
U18 = MCP4901: DAC 8bit SPI; Reviewed by: RM - 2018/08/05; Supplier 1: Digi-Key; Supplier Part Number 1: MCP4901-E/SN-ND

## Sheet DSO_Clock.SchDoc: Schematic_Name
size A4; CompanyName: University of Melbourne; Engineer: Your Name Here; DocumentNumber: 1; Revision: 0.1; SheetNumber: 1; SheetTotal: 1; Title_Project: Project_Title; StudentNo: Student No.
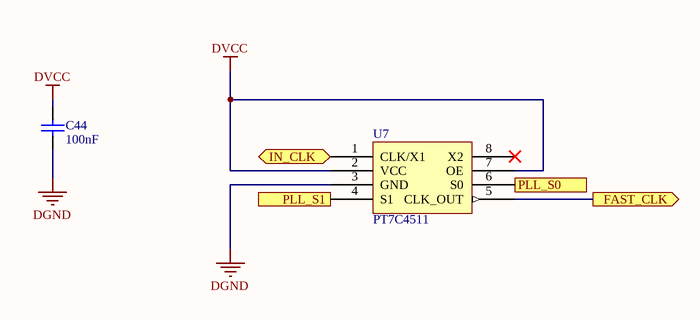
[diagram p8: DSO_Clock.SchDoc]

### Parts
C44  100nF  [0805C]
U7  PT7C4511  [SOIC-8]

### Ports
FAST_CLK (out), IN_CLK (in), PLL_S0 (in), PLL_S1 (in)

### Nets
DGND: C44.2 U7.3(GND)
DVCC: C44.1 U7.2(VCC) U7.7(OE)
FAST_CLK: U7.5(CLK_OUT) ; port FAST_CLK
IN_CLK: U7.1(CLK/X1) ; port IN_CLK
NetU7_4: U7.4(S1) ; port PLL_S1
NetU7_6: U7.6(S0) ; port PLL_S0

Not connected (* = marked no-connect by the designer): U7 8(X2)*

### Library data of the parts
C44 = c: Capacitor; Reviewed by: RM - 2018/08/05; Revision: July-2002: Re-released for DXP Platform.; Supplier 1: *; Supplier Part Number 1: *; Value: 100nF
U7 = PT7C4511: PLL Clock Multiplier; Reviewed by: RM - 2018/08/05; Supplier 1: Digi-Key; Supplier Part Number 1: PT7C4511WEXDICT-ND

## Sheet DSO_IO.SchDoc: Schematic_Name
size A4; CompanyName: University of Melbourne; Engineer: Your Name Here; DocumentNumber: 1; Revision: 0.1; SheetNumber: 1; SheetTotal: 1; Title_Project: Project_Title; StudentNo: Student No.
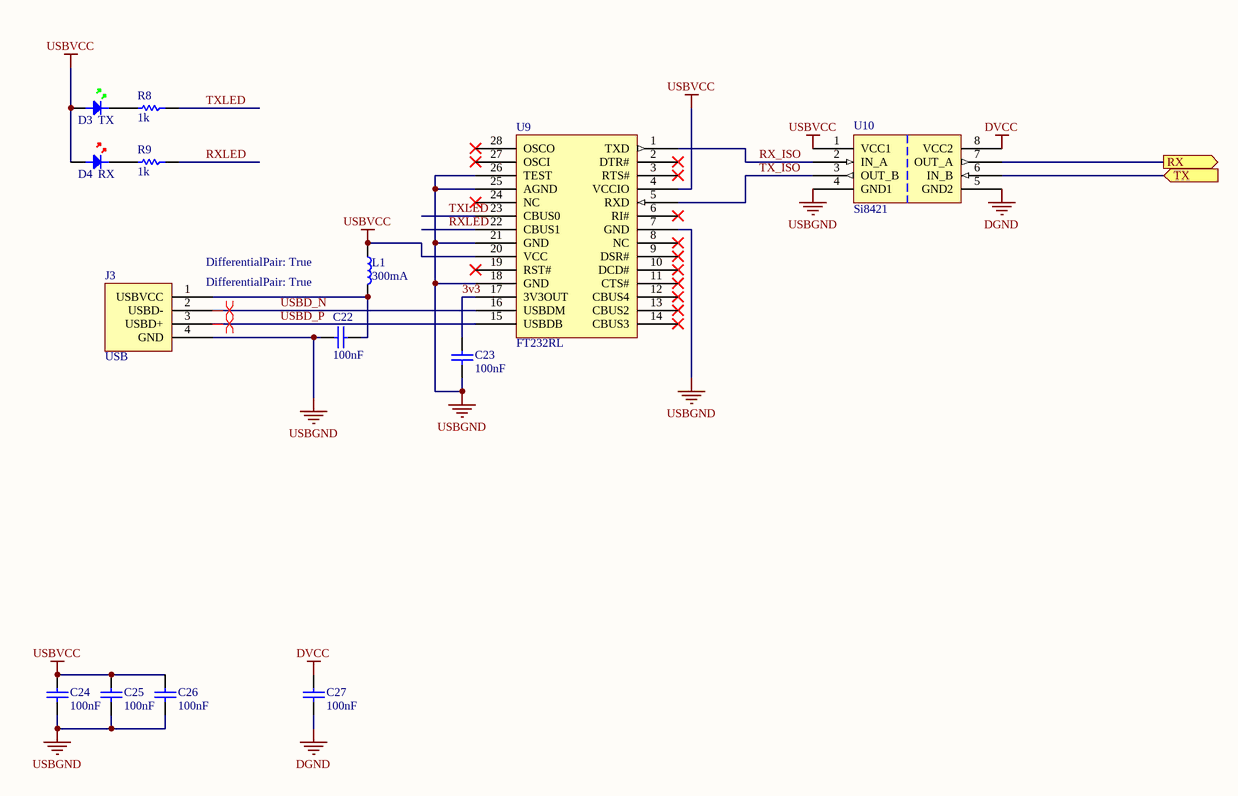
[diagram p9: DSO_IO.SchDoc]

### Parts
C22  100nF  [0805C]
C23  100nF  [0805C]
C24  100nF  [0805C]
C25  100nF  [0805C]
C26  100nF  [0805C]
C27  100nF  [0805C]
D3  TX  [0805D-GREEN]
D4  RX  [0805D-RED]
J3  USB  [USBPLUG]
L1  300mA  [0805]
R8  1k  [0805]
R9  1k  [0805]
U9  FT232RL  [SSOP-28]
U10  Si8421  [SOIC-8]

### Ports
RX (out), TX (in)

### Nets
DGND: C27.2 U10.5(GND2)
DVCC: C27.1 U10.8(VCC2)
USBGND: C22.2 C23.2 C24.2 C25.2 C26.2 J3.4(GND) U9.7(GND) U9.18(GND) U9.21(GND) U9.25(AGND) U9.26(TEST) U10.4(GND1)
USBVCC: C24.1 C25.1 C26.1 D3.A D4.A L1.1 U9.4(VCCIO) U9.20(VCC) U10.1(VCC1)
3v3: C23.1 U9.17(3V3OUT)
RX: U10.7(OUT_A) ; port RX
RX_ISO: U9.1(TXD) U10.2(IN_A)
RXLED: R9.1 U9.22(CBUS1)
TX: U10.6(IN_B) ; port TX
TX_ISO: U9.5(RXD) U10.3(OUT_B)
TXLED: R8.1 U9.23(CBUS0)
USBD_N: J3.2(USBD-) U9.16(USBDM)
USBD_P: J3.3(USBD+) U9.15(USBDB)
NetC22_1: C22.1 J3.1(USBVCC) L1.2
NetD3_K: D3.K R8.2
NetD4_K: D4.K R9.2

Not connected (* = marked no-connect by the designer): U9 2(DTR#)* 3(RTS#)* 6(RI#)* 8(NC)* 9(DSR#)* 10(DCD#)* 11(CTS#)* 12(CBUS4)* 13(CBUS2)* 14(CBUS3)* 19(RST#)* 24(NC)* 27(OSCI)* 28(OSCO)*

### Layout directives
differential pair: USBD_N, USBD_P

### Library data of the parts
C22-C27 = C: Capacitor; Reviewed by: RM - 2018/08/05; Revision: July-2002: Re-released for DXP Platform.; Value: 100nF; Supplier 1: *; Supplier Part Number 1: *
D3 = LED GREEN: Light Emitting Diode; Reviewed by: RM - 2018/08/05; Revision: July-2002: Re-released for DXP Platform.; Supplier 1: Digi-Key; Supplier Part Number 1: 160-1423-1-ND
D4 = LED RED: Light Emitting Diode; Reviewed by: RM - 2018/08/05; Revision: July-2002: Re-released for DXP Platform.; Supplier 1: Digi-Key; Supplier Part Number 1: 475-1415-1-ND
J3 = USBPLUG: USB B Type Connector; Reviewed by: RM - 2018/08/05; Supplier 1: Digi-Key; Supplier Part Number 1: 609-1039-ND
L1 = I: Inductor; Reviewed by: RM - 2018/08/05; Value: 300mA; Supplier 1: *; Supplier Part Number 1: *
R8 R9 = R: Resistor; Reviewed by: RM - 2018/08/05; Value: 1k; Supplier 1: *; Suppler Part Number 1: *
U9 = FT232RL: USB to Serial bridge; Reviewed by: RM - 2018/08/05; Supplier 1: Digi-Key; Supplier Part Number 1: 768-1007-1-ND
U10 = Si8421: Dual Channel Digital Isolator Both Ways; Reviewed by: RM - 2018/08/05; Supplier 1: Digi-Key; Supplier Part Number 1: 336-1755-5-ND

## Sheet DSO_Power.SchDoc: Schematic_Name
size A4; CompanyName: University of Melbourne; Engineer: Your Name Here; DocumentNumber: 1; Revision: 0.1; SheetNumber: 1; SheetTotal: 1; Title_Project: Project_Title; StudentNo: Student No.
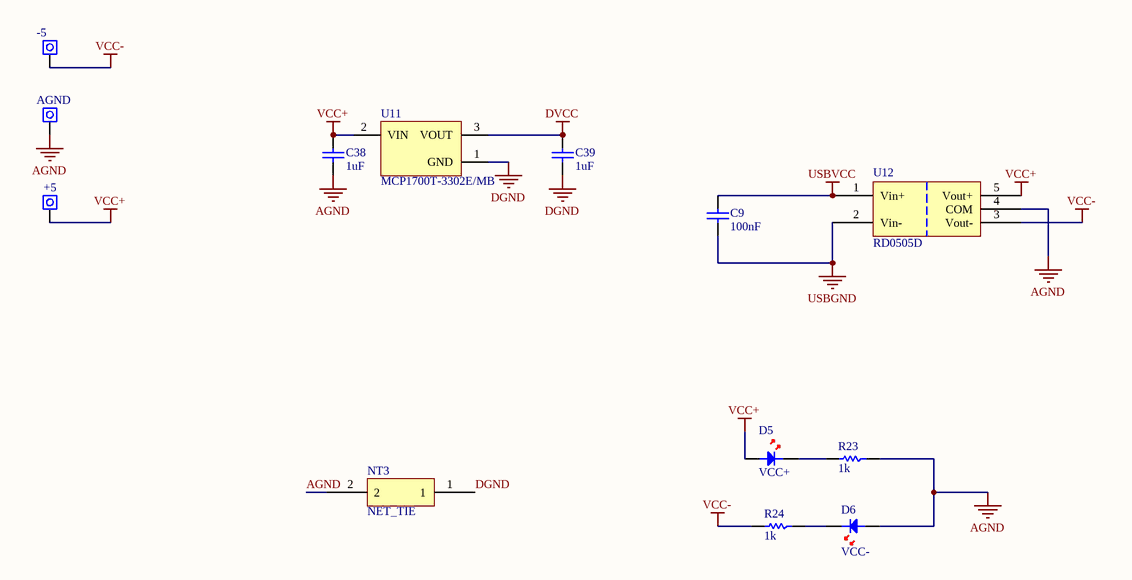
[diagram p10: DSO_Power.SchDoc]

### Parts
C9  100nF  [0805C]
C38  1uF  [0805C]
C39  1uF  [0805C]
D5  VCC+  [0805D-RED]
D6  VCC-  [0805D-RED]
NT3  NET_TIE  [NET_TIE]  (net tie, no BOM)
R23  1k  [0805]
R24  1k  [0805]
TP4  -5  [PIN 1.8mm]
TP5  AGND  [PIN 1.8mm]
TP6  +5  [PIN 1.8mm]
U11  MCP1700T-3302E/MB  [SOT89]
U12  RD0505D  [SIP_NMG]

### Nets
AGND: C38.2 D6.A NT3.2 R23.1 TP5.1 U12.4(COM)
DGND: C39.2 NT3.1 U11.1(GND)
DVCC: C39.1 U11.3(VOUT)
USBGND: C9.2 U12.2(Vin-)
USBVCC: C9.1 U12.1(Vin+)
VCC+: C38.1 D5.A TP6.1 U11.2(VIN) U12.5(Vout+)
VCC-: R24.2 TP4.1 U12.3(Vout-)
NetD5_K: D5.K R23.2
NetD6_K: D6.K R24.1

### Library data of the parts
C9 C38 C39 = C: Capacitor; Reviewed by: RM - 2018/08/05; Revision: July-2002: Re-released for DXP Platform.; Supplier 1: *; Supplier Part Number 1: *
  C9: Value: 100nF
  C38 C39: Value: 1uF
D5 D6 = LED RED: as D4 on sheet DSO_IO; Revision: July-2002: Re-released for DXP Platform.; Supplier 1: Digi-Key; Supplier Part Number 1: 475-1415-1-ND
NT3 = NET_TIE: Net Tie
R23 R24 = R: Resistor; Value: 1k
TP4-TP6 = WIRE: Pad
U11 = MCP1700T: Low Quiescent Current LDO, 3-Pin SOT-89, Extended Temperature, Tape and Reel; Reviewed by: RM - 2018/08/05; Supplier 1: Digi-Key; Supplier Part Number 1: MCP1700T3302EMBCT-ND
U12 = RD0505D: (ADV) DC to DC converter 5V in +-5V out; Reviewed by: RM - 2018/08/05; Supplier Part Number 1: 945-1136-ND; Supplier 1: Digi-Key

## Sheet DSO_Mechanical.SchDoc
size A
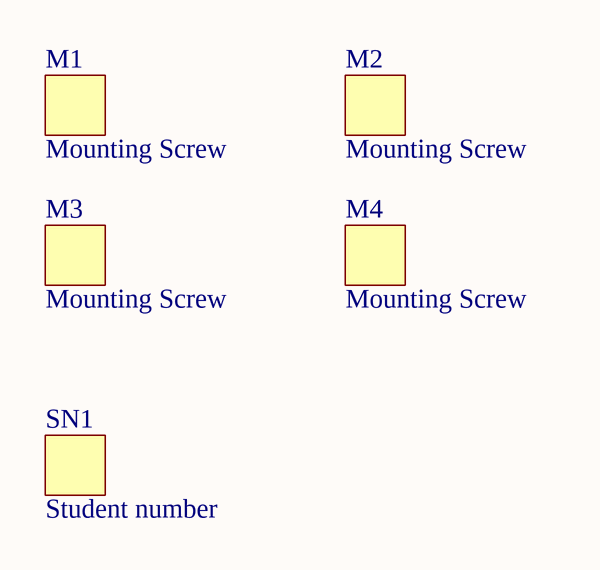
[diagram p11: DSO_Mechanical.SchDoc]

### Parts
M1  Mounting Screw  [MOUNT_SCREW]  (no BOM)
M2  Mounting Screw  [MOUNT_SCREW]  (no BOM)
M3  Mounting Screw  [MOUNT_SCREW]  (no BOM)
M4  Mounting Screw  [MOUNT_SCREW]  (no BOM)
SN1  Student number  [STUDENT NUM]  (no BOM)

### Library data of the parts
SN1 = STUDENT_NUM

## Nets that join several sheets
AGND: DSO_Front (8 pins), DSO_ADC (14 pins), DSO_Trig (5 pins), DSO_Power (6 pins)
DGND: DSO_ADC (C41.2 U2.10 U2.19), DSO_RAM (5 pins), DSO_Counters (6 pins), DSO_CPLD (27 pins), DSO_Control (21 pins), DSO_Clock (C44.2 U7.3), DSO_IO (C27.2 U10.5), DSO_Power (C39.2 NT3.1 U11.1)
DVCC: DSO_ADC (C37.2 C41.1 U2.20 U3.20), DSO_RAM (5 pins), DSO_Counters (C5.1 C6.1 U4.16 U5.16), DSO_CPLD (7 pins), DSO_Control (17 pins), DSO_Trig (6 pins), DSO_Clock (C44.1 U7.2 U7.7), DSO_IO (C27.1 U10.8), DSO_Power (C39.1 U11.3)
USBGND: DSO_IO (12 pins), DSO_Power (C9.2 U12.2)
USBVCC: DSO_IO (9 pins), DSO_Power (C9.1 U12.1)
VCC+: DSO_Front (C45.1 D1.K U1.8), DSO_ADC (5 pins), DSO_Trig (8 pins), DSO_Power (5 pins)
VCC-: DSO_Front (C46.1 D2.A U1.4), DSO_ADC (C47.1 U16.4), DSO_Power (R24.2 TP4.1 U12.3)
ADC_A0: DSO_RAM (U6.16), DSO_Counters (U4.15)
ADC_A1: DSO_RAM (U6.15), DSO_Counters (U4.1)
ADC_A2: DSO_RAM (U6.14), DSO_Counters (U4.2)
ADC_A3: DSO_RAM (U6.13), DSO_Counters (U4.3)
ADC_A4: DSO_RAM (U6.4), DSO_Counters (U4.4)
ADC_A5: DSO_RAM (U6.3), DSO_Counters (U4.5)
ADC_A6: DSO_RAM (U6.2), DSO_Counters (U4.6)
ADC_A7: DSO_RAM (U6.1), DSO_Counters (U4.7)
ADC_A8: DSO_RAM (U6.31), DSO_Counters (U5.15)
ADC_A9: DSO_RAM (U6.30), DSO_Counters (U5.1)
ADC_A10: DSO_RAM (U6.29), DSO_Counters (U5.2)
ADC_A11: DSO_RAM (U6.21), DSO_Counters (U5.3)
ADC_A12: DSO_RAM (U6.20), DSO_Counters (U5.4)
ADC_A13: DSO_RAM (U6.19), DSO_Counters (U5.5)
ADC_A14: DSO_RAM (U6.18), DSO_Counters (U5.6)
ADC_A15: DSO_RAM (U6.17), DSO_Counters (U5.7)
ADC_CLK: DSO_ADC (U3.10), DSO_RAM (TP_ADC_CLK.1 U6.12), DSO_CPLD (U13.41)
ADC_D0: DSO_ADC (U2.11), DSO_RAM (U6.6), DSO_Control (U8.30)
ADC_D1: DSO_ADC (U2.12), DSO_RAM (U6.7), DSO_Control (U8.31)
ADC_D2: DSO_ADC (U2.13), DSO_RAM (U6.10), DSO_Control (U8.32)
ADC_D3: DSO_ADC (U2.14), DSO_RAM (U6.11), DSO_Control (U8.33)
ADC_D4: DSO_ADC (U2.15), DSO_RAM (U6.22), DSO_Control (U8.34)
ADC_D5: DSO_ADC (U2.16), DSO_RAM (U6.23), DSO_Control (U8.35)
ADC_D6: DSO_ADC (U2.17), DSO_RAM (U6.26), DSO_Control (U8.36)
ADC_D7: DSO_ADC (U2.18), DSO_RAM (U6.27), DSO_Control (U8.37)
CH1_NORM: DSO_ADC (C32.1 R14.1 TP_ADC_IN.1 U3.17), DSO_Trig (U17.3)
CLEAR_COUNT: DSO_Counters (U4.10 U5.10), DSO_CPLD (U13.31)
COUNTER_CLK: DSO_Counters (U4.11 U4.13 U5.13), DSO_CPLD (U13.29)
EDGE_SW: DSO_CPLD (U13.5), DSO_Control (U8.19)
ENABLE: DSO_CPLD (U13.1), DSO_Control (U8.16)
ENABLE_COUNT: DSO_Counters (U4.12 U5.12), DSO_CPLD (U13.30)
FAST_CLK: DSO_CPLD (U13.44), DSO_Clock (U7.5)
FILL_COMP: DSO_CPLD (U13.28), DSO_Control (U8.11)
FORCE: DSO_CPLD (U13.2), DSO_Control (U8.25)
FULL: DSO_Counters (U5.9), DSO_CPLD (U13.7)
IN_CLK: DSO_Control (U8.13), DSO_Clock (U7.1)
NetR6_2: DSO_Front (TP_BUF.1 U1.1 U1.2), DSO_ADC (R6.2)
NetU7_4: DSO_Control (U8.15), DSO_Clock (U7.4)
NetU7_6: DSO_Control (U8.14), DSO_Clock (U7.6)
NetU13_12: DSO_CPLD (U13.12), DSO_Trig (U17.1)
~{RAM_READ}: DSO_RAM (U6.28), DSO_CPLD (U13.6)
RAM_READ: DSO_ADC (U2.1), DSO_CPLD (U13.3), DSO_Control (U8.44)
RX: DSO_Control (U8.9), DSO_IO (U10.7)
SCK: DSO_Control (P1.3 U8.3), DSO_Trig (Q2.2 R19.1)
SDA: DSO_Control (P1.4 U8.1), DSO_Trig (Q3.2 R21.1)
SLOW_CLK: DSO_CPLD (U13.43), DSO_Control (U8.43)
T_CS: DSO_Control (U8.26), DSO_Trig (Q1.2 R17.1)
TX: DSO_Control (U8.10), DSO_IO (U10.6)